# Altium project MKXdbV2.PrjPCB (part 1 of 2)
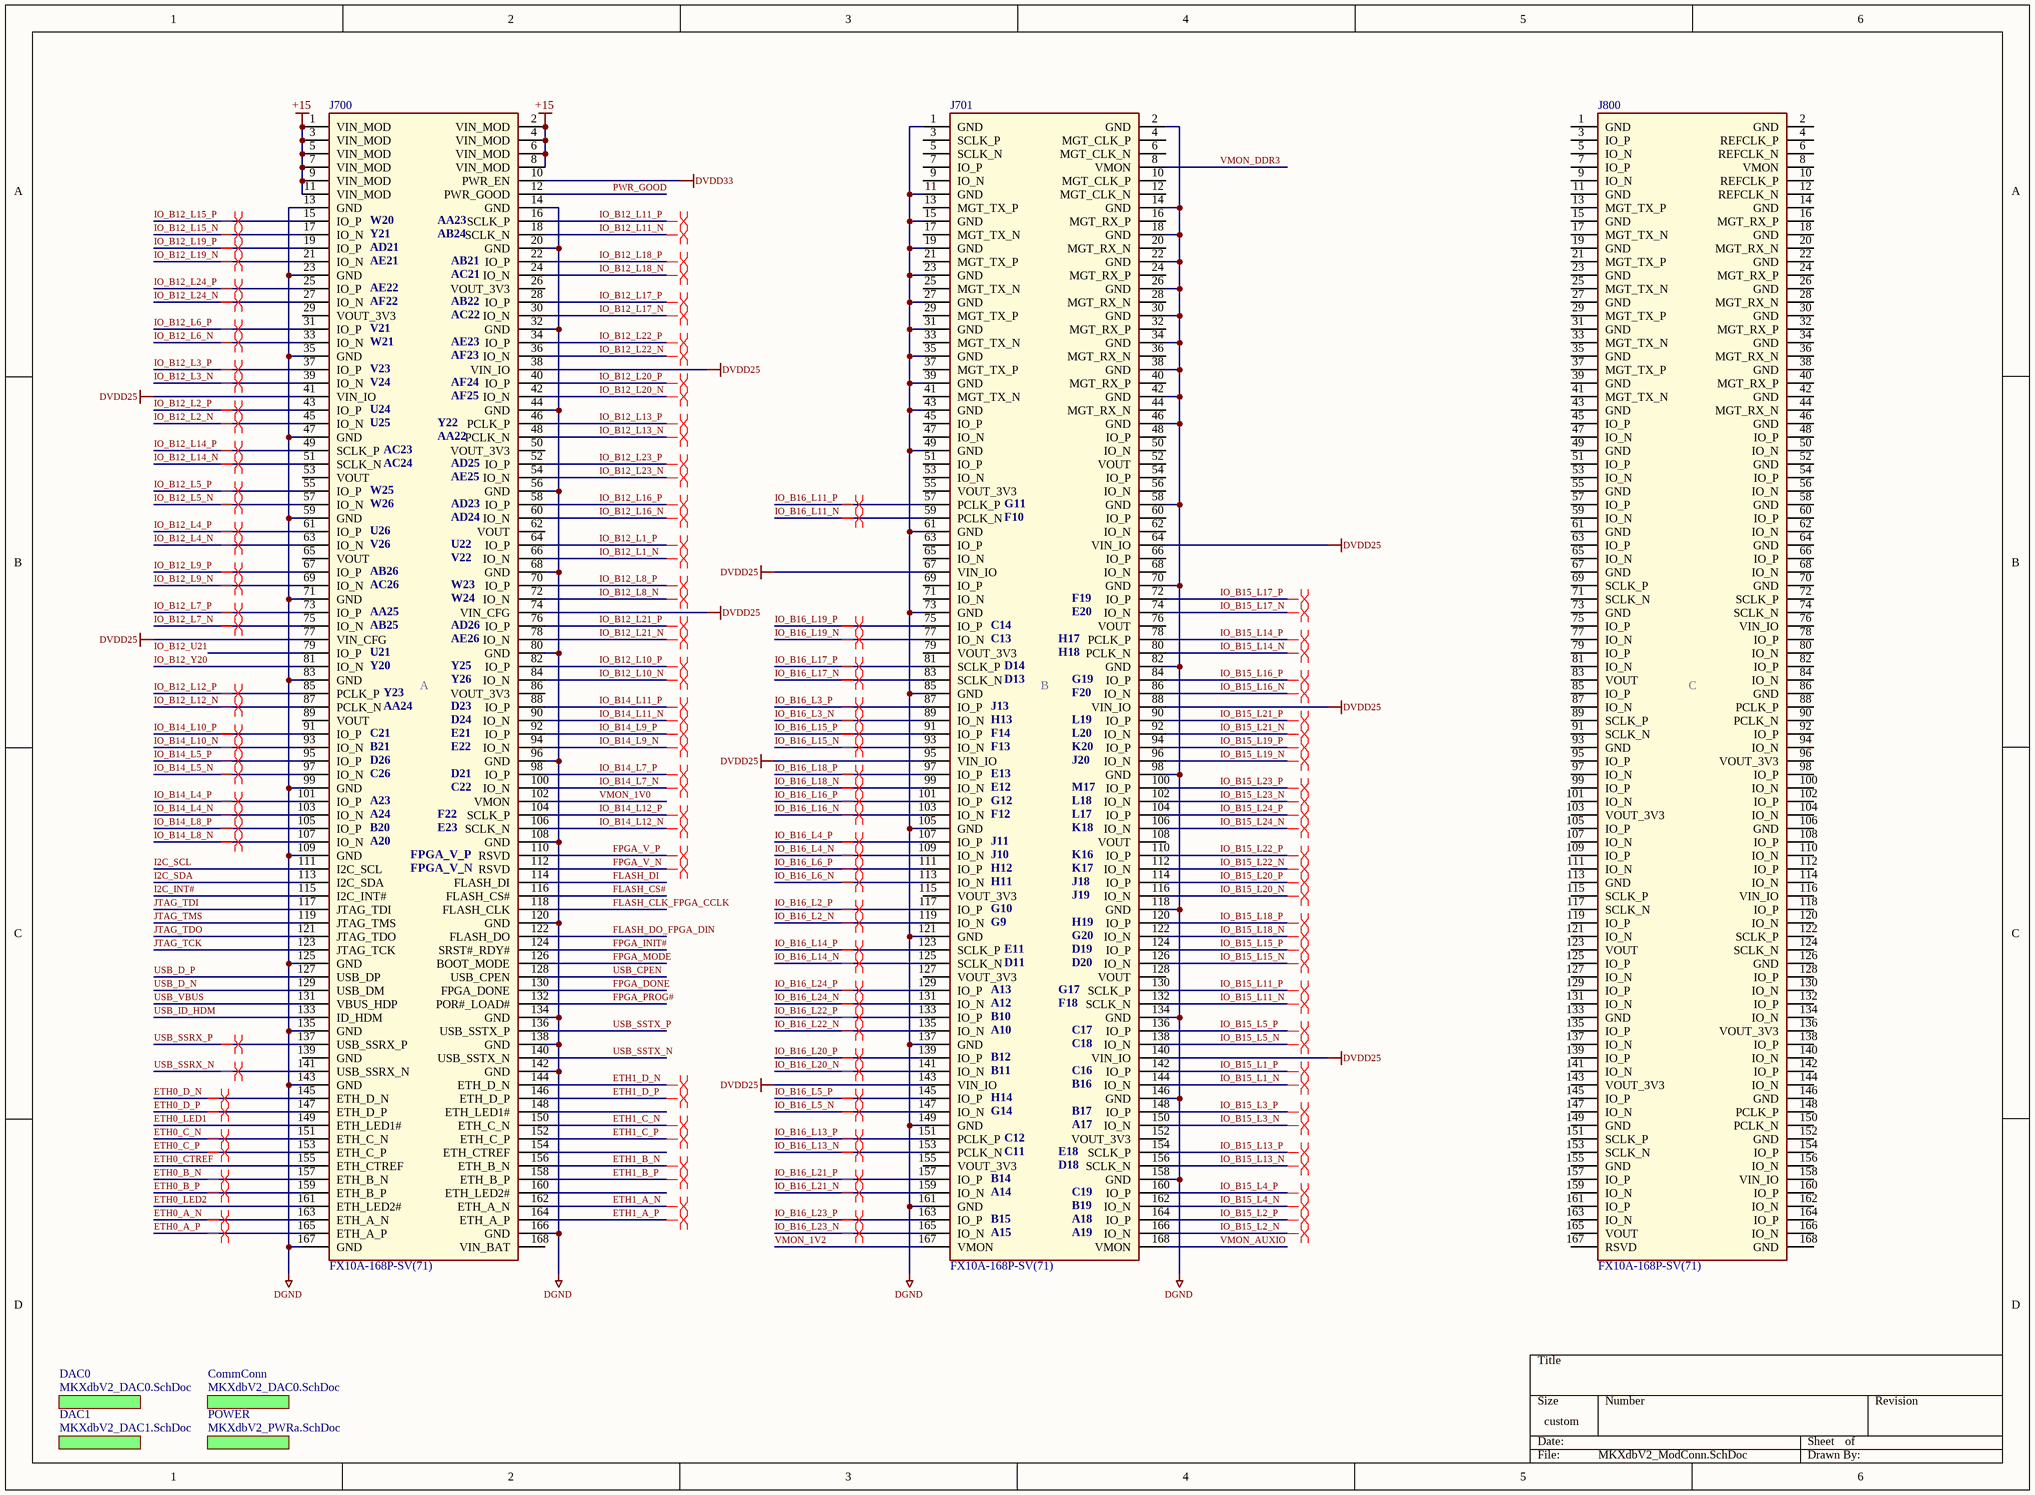
[diagram p0: MKXdbV2_ModConn.SchDoc]
6 sheets, 269 parts. Net scope: global (net labels, ports and power ports of the same name join across sheets).
Sheets:
  MKXdbV2_ModConn.SchDoc
    DAC1 = MKXdbV2_DAC1.SchDoc
    DAC0 = MKXdbV2_DAC0.SchDoc
    CommConn = MKXdbV2_DAC0.SchDoc
  MKXdbV2_PWR.SchDoc
  MKXdbV2_ADC0.SchDoc
  MKXdbV2_ADC1.SchDoc

## Sheet MKXdbV2_ModConn.SchDoc: Mercury KX1/2 daughterboard v2
size 381 x 279 mm; Date: 10 September 2017; DrawnBy: Daniel Schussheim; Revision: version 2; ProjectName: MKXbdV2

### Parts
J700  FX10A-168P-SV(71)  [Mercury_Baseboard_Connector]
J701  FX10A-168P-SV(71)  [Mercury_Baseboard_Connector]
J800  FX10A-168P-SV(71)  [Mercury_Baseboard_Connector]

### Sub-sheets
CommConn = MKXdbV2_DAC0.SchDoc: no entries
DAC0 = MKXdbV2_DAC0.SchDoc: no entries
DAC1 = MKXdbV2_DAC1.SchDoc: no entries
POWER = MKXdbV2_PWRa.SchDoc (file not in this document): no entries

### Nets
+15: J700.1(VIN_MOD) J700.2(VIN_MOD) J700.3(VIN_MOD) J700.4(VIN_MOD) J700.5(VIN_MOD) J700.6(VIN_MOD) J700.7(VIN_MOD) J700.8(VIN_MOD) J700.9(VIN_MOD) J700.11(VIN_MOD)
DGND: J700.13(GND) J700.14(GND) J700.20(GND) J700.23(GND) J700.32(GND) J700.35(GND) J700.44(GND) J700.47(GND) J700.56(GND) J700.59(GND) J700.68(GND) J700.71(GND) J700.80(GND) J700.83(GND) J700.96(GND) J700.99(GND) J700.108(GND) J700.109(GND) J700.120(GND) J700.125(GND) J700.134(GND) J700.135(GND) J700.138(GND) J700.142(GND) J700.143(GND) J700.166(GND) J700.167(GND) J701.1(GND) J701.2(GND) J701.11(GND) J701.14(GND) J701.15(GND) J701.18(GND) J701.19(GND) J701.22(GND) J701.23(GND) J701.26(GND) J701.27(GND) J701.30(GND) J701.31(GND) J701.34(GND) J701.35(GND) J701.38(GND) J701.39(GND) J701.42(GND) J701.43(GND) J701.46(GND) J701.49(GND) J701.58(GND) J701.61(GND) J701.70(GND) J701.73(GND) J701.82(GND) J701.85(GND) J701.98(GND) J701.105(GND) J701.118(GND) J701.121(GND) J701.134(GND) J701.137(GND) J701.146(GND) J701.149(GND) J701.158(GND) J701.161(GND)  [project net AGND]
DVDD25: J700.38(VIN_IO) J700.41(VIN_IO) J700.74(VIN_CFG) J700.77(VIN_CFG) J701.64(VIN_IO) J701.67(VIN_IO) J701.88(VIN_IO) J701.95(VIN_IO) J701.140(VIN_IO) J701.143(VIN_IO)
DVDD33: J700.10(PWR_EN)
ETH0_A_N: J700.163(ETH_A_N)
ETH0_A_P: J700.165(ETH_A_P)
ETH0_B_N: J700.157(ETH_B_N)
ETH0_B_P: J700.159(ETH_B_P)
ETH0_C_N: J700.151(ETH_C_N)
ETH0_C_P: J700.153(ETH_C_P)
ETH0_CTREF: J700.155(ETH_CTREF)
ETH0_D_N: J700.145(ETH_D_N)
ETH0_D_P: J700.147(ETH_D_P)
ETH0_LED1: J700.149(ETH_LED1#)
ETH0_LED2: J700.161(ETH_LED2#)
ETH1_A_N: J700.162(ETH_A_N)
ETH1_A_P: J700.164(ETH_A_P)
ETH1_B_N: J700.156(ETH_B_N)
ETH1_B_P: J700.158(ETH_B_P)
ETH1_C_N: J700.150(ETH_C_N)
ETH1_C_P: J700.152(ETH_C_P)
ETH1_D_N: J700.144(ETH_D_N)
ETH1_D_P: J700.146(ETH_D_P)
FLASH_CLK_FPGA_CCLK: J700.118(FLASH_CLK)
FLASH_CS#: J700.116(FLASH_CS#)
FLASH_DI: J700.114(FLASH_DI)
FLASH_DO_FPGA_DIN: J700.122(FLASH_DO)
FPGA_DONE: J700.130(FPGA_DONE)
FPGA_INIT#: J700.124(SRST#_RDY#)
FPGA_MODE: J700.126(BOOT_MODE)
FPGA_PROG#: J700.132(POR#_LOAD#)
FPGA_V_N: J700.112(RSVD)
FPGA_V_P: J700.110(RSVD)
I2C_INT#: J700.115(I2C_INT#)
I2C_SCL: J700.111(I2C_SCL)
I2C_SDA: J700.113(I2C_SDA)
IO_B12_L1_N: J700.66(IO_N)
IO_B12_L1_P: J700.64(IO_P)
IO_B12_L2_N: J700.45(IO_N)
IO_B12_L2_P: J700.43(IO_P)
IO_B12_L3_N: J700.39(IO_N)
IO_B12_L3_P: J700.37(IO_P)
IO_B12_L4_N: J700.63(IO_N)
IO_B12_L4_P: J700.61(IO_P)
IO_B12_L5_N: J700.57(IO_N)
IO_B12_L5_P: J700.55(IO_P)
IO_B12_L6_N: J700.33(IO_N)
IO_B12_L6_P: J700.31(IO_P)
IO_B12_L7_N: J700.75(IO_N)
IO_B12_L7_P: J700.73(IO_P)
IO_B12_L8_N: J700.72(IO_N)
IO_B12_L8_P: J700.70(IO_P)
IO_B12_L9_N: J700.69(IO_N)
IO_B12_L9_P: J700.67(IO_P)
IO_B12_L10_N: J700.84(IO_N)
IO_B12_L10_P: J700.82(IO_P)
IO_B12_L11_N: J700.18(SCLK_N)
IO_B12_L11_P: J700.16(SCLK_P)
IO_B12_L12_N: J700.87(PCLK_N)
IO_B12_L12_P: J700.85(PCLK_P)
IO_B12_L13_N: J700.48(PCLK_N)
IO_B12_L13_P: J700.46(PCLK_P)
IO_B12_L14_N: J700.51(SCLK_N)
IO_B12_L14_P: J700.49(SCLK_P)
IO_B12_L15_N: J700.17(IO_N)
IO_B12_L15_P: J700.15(IO_P)
IO_B12_L16_N: J700.60(IO_N)
IO_B12_L16_P: J700.58(IO_P)
IO_B12_L17_N: J700.30(IO_N)
IO_B12_L17_P: J700.28(IO_P)
IO_B12_L18_N: J700.24(IO_N)
IO_B12_L18_P: J700.22(IO_P)
IO_B12_L19_N: J700.21(IO_N)
IO_B12_L19_P: J700.19(IO_P)
IO_B12_L20_N: J700.42(IO_N)
IO_B12_L20_P: J700.40(IO_P)
IO_B12_L21_N: J700.78(IO_N)
IO_B12_L21_P: J700.76(IO_P)
IO_B12_L22_N: J700.36(IO_N)
IO_B12_L22_P: J700.34(IO_P)
IO_B12_L23_N: J700.54(IO_N)
IO_B12_L23_P: J700.52(IO_P)
IO_B12_L24_N: J700.27(IO_N)
IO_B12_L24_P: J700.25(IO_P)
IO_B12_Y20: J700.81(IO_N)
IO_B14_L4_N: J700.103(IO_N)
IO_B14_L4_P: J700.101(IO_P)
IO_B14_L5_N: J700.97(IO_N)
IO_B14_L5_P: J700.95(IO_P)
IO_B14_L7_N: J700.100(IO_N)
IO_B14_L7_P: J700.98(IO_P)
IO_B14_L8_N: J700.107(IO_N)
IO_B14_L8_P: J700.105(IO_P)
IO_B14_L9_N: J700.94(IO_N)
IO_B14_L9_P: J700.92(IO_P)
IO_B14_L10_N: J700.93(IO_N)
IO_B14_L10_P: J700.91(IO_P)
IO_B14_L11_N: J700.90(IO_N)
IO_B14_L11_P: J700.88(IO_P)
IO_B14_L12_N: J700.106(SCLK_N)
IO_B14_L12_P: J700.104(SCLK_P)
IO_B15_L1_N: J701.144(IO_N)
IO_B15_L1_P: J701.142(IO_P)
IO_B15_L2_N: J701.166(IO_N)
IO_B15_L2_P: J701.164(IO_P)
IO_B15_L3_N: J701.150(IO_N)
IO_B15_L3_P: J701.148(IO_P)
IO_B15_L4_N: J701.162(IO_N)
IO_B15_L4_P: J701.160(IO_P)
IO_B15_L5_N: J701.138(IO_N)
IO_B15_L5_P: J701.136(IO_P)
IO_B15_L11_N: J701.132(SCLK_N)
IO_B15_L11_P: J701.130(SCLK_P)
IO_B15_L13_N: J701.156(SCLK_N)
IO_B15_L13_P: J701.154(SCLK_P)
IO_B15_L14_N: J701.80(PCLK_N)
IO_B15_L14_P: J701.78(PCLK_P)
IO_B15_L15_N: J701.126(IO_N)
IO_B15_L15_P: J701.124(IO_P)
IO_B15_L16_N: J701.86(IO_N)
IO_B15_L16_P: J701.84(IO_P)
IO_B15_L17_N: J701.74(IO_N)
IO_B15_L17_P: J701.72(IO_P)
IO_B15_L18_N: J701.122(IO_N)
IO_B15_L18_P: J701.120(IO_P)
IO_B15_L19_N: J701.96(IO_N)
IO_B15_L19_P: J701.94(IO_P)
IO_B15_L20_N: J701.116(IO_N)
IO_B15_L20_P: J701.114(IO_P)
IO_B15_L21_N: J701.92(IO_N)
IO_B15_L21_P: J701.90(IO_P)
IO_B15_L22_N: J701.112(IO_N)
IO_B15_L22_P: J701.110(IO_P)
IO_B15_L23_N: J701.102(IO_N)
IO_B15_L23_P: J701.100(IO_P)
IO_B15_L24_N: J701.106(IO_N)
IO_B15_L24_P: J701.104(IO_P)
IO_B16_L2_N: J701.119(IO_N)
IO_B16_L2_P: J701.117(IO_P)
IO_B16_L3_N: J701.89(IO_N)
IO_B16_L3_P: J701.87(IO_P)
IO_B16_L4_N: J701.109(IO_N)
IO_B16_L4_P: J701.107(IO_P)
IO_B16_L5_N: J701.147(IO_N)
IO_B16_L5_P: J701.145(IO_P)
IO_B16_L6_N: J701.113(IO_N)
IO_B16_L6_P: J701.111(IO_P)
IO_B16_L11_N: J701.59(PCLK_N)
IO_B16_L11_P: J701.57(PCLK_P)
IO_B16_L13_N: J701.153(PCLK_N)
IO_B16_L13_P: J701.151(PCLK_P)
IO_B16_L14_N: J701.125(SCLK_N)
IO_B16_L14_P: J701.123(SCLK_P)
IO_B16_L15_N: J701.93(IO_N)
IO_B16_L15_P: J701.91(IO_P)
IO_B16_L16_N: J701.103(IO_N)
IO_B16_L16_P: J701.101(IO_P)
IO_B16_L17_N: J701.83(SCLK_N)
IO_B16_L17_P: J701.81(SCLK_P)
IO_B16_L18_N: J701.99(IO_N)
IO_B16_L18_P: J701.97(IO_P)
IO_B16_L19_N: J701.77(IO_N)
IO_B16_L19_P: J701.75(IO_P)
IO_B16_L20_N: J701.141(IO_N)
IO_B16_L20_P: J701.139(IO_P)
IO_B16_L21_N: J701.159(IO_N)
IO_B16_L21_P: J701.157(IO_P)
IO_B16_L22_N: J701.135(IO_N)
IO_B16_L22_P: J701.133(IO_P)
IO_B16_L23_N: J701.165(IO_N)
IO_B16_L23_P: J701.163(IO_P)
IO_B16_L24_N: J701.131(IO_N)
IO_B16_L24_P: J701.129(IO_P)
JTAG_TCK: J700.123(JTAG_TCK)
JTAG_TDI: J700.117(JTAG_TDI)
JTAG_TDO: J700.121(JTAG_TDO)
JTAG_TMS: J700.119(JTAG_TMS)
PWR_GOOD: J700.12(PWR_GOOD)
USB_CPEN: J700.128(USB_CPEN)
USB_D_N: J700.129(USB_DM)
USB_D_P: J700.127(USB_DP)
USB_ID_HDM: J700.133(ID_HDM)
USB_SSRX_N: J700.141(USB_SSRX_N)
USB_SSRX_P: J700.137(USB_SSRX_P)
USB_SSTX_N: J700.140(USB_SSTX_N)
USB_SSTX_P: J700.136(USB_SSTX_P)
USB_VBUS: J700.131(VBUS_HDP)
VMON_1V0: J700.102(VMON)
VMON_1V2: J701.167(VMON)
VMON_AUXIO: J701.168(VMON)
VMON_DDR3: J701.8(VMON)

Not connected (* = marked no-connect by the designer): J700 26(VOUT_3V3) 29(VOUT_3V3) 50(VOUT_3V3) 53(VOUT) 62(VOUT) 65(VOUT) 79(IO_P) 86(VOUT_3V3) 89(VOUT) 139(GND) 148(ETH_LED1#) 154(ETH_CTREF) 160(ETH_LED2#) 168(VIN_BAT); J701 3(SCLK_P) 4(MGT_CLK_P) 5(SCLK_N) 6(MGT_CLK_N) 7(IO_P) 9(IO_N) 10(MGT_CLK_P) 12(MGT_CLK_N) 13(MGT_TX_P) 16(MGT_RX_P) 17(MGT_TX_N) 20(MGT_RX_N) 21(MGT_TX_P) 24(MGT_RX_P) 25(MGT_TX_N) 28(MGT_RX_N) 29(MGT_TX_P) 32(MGT_RX_P) 33(MGT_TX_N) 36(MGT_RX_N) 37(MGT_TX_P) 40(MGT_RX_P) 41(MGT_TX_N) 44(MGT_RX_N) 45(IO_P) 47(IO_N) 48(IO_P) 50(IO_N) 51(IO_P) 52(VOUT) 53(IO_N) 54(IO_P) 55(VOUT_3V3) 56(IO_N) 60(IO_P) 62(IO_N) 63(IO_P) 65(IO_N) 66(IO_P) 68(IO_N) 69(IO_P) 71(IO_N) 76(VOUT) 79(VOUT_3V3) 108(VOUT) 115(VOUT_3V3) 127(VOUT_3V3) 128(VOUT) 152(VOUT_3V3) 155(VOUT_3V3); J800 1(GND) 2(GND) 3(IO_P) 4(REFCLK_P) 5(IO_N) 6(REFCLK_N) 7(IO_P) 8(VMON) 9(IO_N) 10(REFCLK_P) 11(GND) 12(REFCLK_N) 13(MGT_TX_P) 14(GND) 15(GND) 16(MGT_RX_P) 17(MGT_TX_N) 18(GND) 19(GND) 20(MGT_RX_N) 21(MGT_TX_P) 22(GND) 23(GND) 24(MGT_RX_P) 25(MGT_TX_N) 26(GND) 27(GND) 28(MGT_RX_N) 29(MGT_TX_P) 30(GND) 31(GND) 32(MGT_RX_P) 33(MGT_TX_N) 34(GND) 35(GND) 36(MGT_RX_N) 37(MGT_TX_P) 38(GND) 39(GND) 40(MGT_RX_P) 41(MGT_TX_N) 42(GND) 43(GND) 44(MGT_RX_N) 45(IO_P) 46(GND) 47(IO_N) 48(IO_P) 49(GND) 50(IO_N) 51(IO_P) 52(GND) 53(IO_N) 54(IO_P) 55(GND) 56(IO_N) 57(IO_P) 58(GND) 59(IO_N) 60(IO_P) 61(GND) 62(IO_N) 63(IO_P) 64(GND) 65(IO_N) 66(IO_P) 67(GND) 68(IO_N) 69(SCLK_P) 70(GND) 71(SCLK_N) 72(SCLK_P) 73(GND) 74(SCLK_N) 75(IO_P) 76(VIN_IO) 77(IO_N) 78(IO_P) 79(IO_P) 80(IO_N) 81(IO_N) 82(IO_P) 83(VOUT) 84(IO_N) 85(IO_P) 86(GND) 87(IO_N) 88(PCLK_P) 89(SCLK_P) 90(PCLK_N) 91(SCLK_N) 92(IO_P) 93(GND) 94(IO_N) 95(IO_P) 96(VOUT_3V3) 97(IO_N) 98(IO_P) 99(IO_P) 100(IO_N) 101(IO_N) 102(IO_P) 103(VOUT_3V3) 104(IO_N) 105(IO_P) 106(GND) 107(IO_N) 108(IO_P) 109(IO_P) 110(IO_N) 111(IO_N) 112(IO_P) 113(GND) 114(IO_N) 115(SCLK_P) 116(VIN_IO) 117(SCLK_N) 118(IO_P) 119(IO_P) 120(IO_N) 121(IO_N) 122(SCLK_P) 123(VOUT) 124(SCLK_N) 125(IO_P) 126(GND) 127(IO_N) 128(IO_P) 129(IO_P) 130(IO_N) 131(IO_N) 132(IO_P) 133(GND) 134(IO_N) 135(IO_P) 136(VOUT_3V3) 137(IO_N) 138(IO_P) 139(IO_P) 140(IO_N) 141(IO_N) 142(IO_P) 143(VOUT_3V3) 144(IO_N) 145(IO_P) 146(GND) 147(IO_N) 148(PCLK_P) 149(GND) 150(PCLK_N) 151(SCLK_P) 152(GND) 153(SCLK_N) 154(IO_P) 155(GND) 156(IO_N) 157(IO_P) 158(VIN_IO) 159(IO_N) 160(IO_P) 161(IO_P) 162(IO_N) 163(IO_N) 164(IO_P) 165(VOUT) 166(IO_N) 167(RSVD) 168(GND)

### Layout directives
differential pair: ETH0_A_N, ETH0_A_P, ETH0_B_N, ETH0_B_P, ETH0_C_N, ETH0_C_P, ETH0_D_N, ETH0_D_P, ETH1_A_N, ETH1_A_P, ETH1_B_N, ETH1_B_P, ETH1_C_N, ETH1_C_P, ETH1_D_N, ETH1_D_P, FPGA_V_N, FPGA_V_P, IO_B12_L1_N, IO_B12_L1_P, IO_B12_L2_N, IO_B12_L2_P, IO_B12_L3_N, IO_B12_L3_P, IO_B12_L4_N, IO_B12_L4_P, IO_B12_L5_N, IO_B12_L5_P, IO_B12_L6_N, IO_B12_L6_P, IO_B12_L7_N, IO_B12_L7_P, IO_B12_L8_N, IO_B12_L8_P, IO_B12_L9_N, IO_B12_L9_P, IO_B12_L10_N, IO_B12_L10_P, IO_B12_L11_N, IO_B12_L11_P, IO_B12_L12_N, IO_B12_L12_P, IO_B12_L13_N, IO_B12_L13_P, IO_B12_L14_N, IO_B12_L14_P, IO_B12_L15_N, IO_B12_L15_P, IO_B12_L16_N, IO_B12_L16_P, IO_B12_L17_N, IO_B12_L17_P, IO_B12_L18_N, IO_B12_L18_P, IO_B12_L19_N, IO_B12_L19_P, IO_B12_L20_N, IO_B12_L20_P, IO_B12_L21_N, IO_B12_L21_P, IO_B12_L22_N, IO_B12_L22_P, IO_B12_L23_N, IO_B12_L23_P, IO_B12_L24_N, IO_B12_L24_P, IO_B14_L4_N, IO_B14_L4_P, IO_B14_L5_N, IO_B14_L5_P, IO_B14_L7_N, IO_B14_L7_P, IO_B14_L8_N, IO_B14_L8_P, IO_B14_L9_N, IO_B14_L9_P, IO_B14_L10_N, IO_B14_L10_P, IO_B14_L11_N, IO_B14_L11_P, IO_B14_L12_N, IO_B14_L12_P, IO_B15_L1_N, IO_B15_L1_P, IO_B15_L2_N, IO_B15_L2_P, IO_B15_L3_N, IO_B15_L3_P, IO_B15_L4_N, IO_B15_L4_P, IO_B15_L5_N, IO_B15_L5_P, IO_B15_L11_N, IO_B15_L11_P, IO_B15_L13_N, IO_B15_L13_P, IO_B15_L14_N, IO_B15_L14_P, IO_B15_L15_N, IO_B15_L15_P, IO_B15_L16_N, IO_B15_L16_P, IO_B15_L17_N, IO_B15_L17_P, IO_B15_L18_N, IO_B15_L18_P, IO_B15_L19_N, IO_B15_L19_P, IO_B15_L20_N, IO_B15_L20_P, IO_B15_L21_N, IO_B15_L21_P, IO_B15_L22_N, IO_B15_L22_P, IO_B15_L23_N, IO_B15_L23_P, IO_B15_L24_N, IO_B15_L24_P, IO_B16_L2_N, IO_B16_L2_P, IO_B16_L3_N, IO_B16_L3_P, IO_B16_L4_N, IO_B16_L4_P, IO_B16_L5_N, IO_B16_L5_P, IO_B16_L6_N, IO_B16_L6_P, IO_B16_L11_N, IO_B16_L11_P, IO_B16_L13_N, IO_B16_L13_P, IO_B16_L14_N, IO_B16_L14_P, IO_B16_L15_N, IO_B16_L15_P, IO_B16_L16_N, IO_B16_L16_P, IO_B16_L17_N, IO_B16_L17_P, IO_B16_L18_N, IO_B16_L18_P, IO_B16_L19_N, IO_B16_L19_P, IO_B16_L20_N, IO_B16_L20_P, IO_B16_L21_N, IO_B16_L21_P, IO_B16_L22_N, IO_B16_L22_P, IO_B16_L23_N, IO_B16_L23_P, IO_B16_L24_N, IO_B16_L24_P, USB_SSRX_N, USB_SSRX_P

### Notes on the sheet
- (near J700) W20
- (near J700) AA23
- (near J700) Y21
- (near J700) AD21
- (near J700) AE21
- (near J700) AE22
- (near J700) AF22
- (near J700) AB24
- (near J700) AB21
- (near J700) AC21
- (near J700) AB22
- (near J700) V21
- (near J700) W21
- (near J700) AC22
- (near J700) AE23
- (near J700) AF23
- (near J700) V23
- (near J700) V24
- (near J700) U24
- (near J700) U25
- (near J700) Y22
- (near J700) AA22
- (near J700) AF24
- (near J700) AF25
- (near J700) W25
- (near J700) AC23
- (near J700) AC24
- (near J700) AD25
- (near J700) AE25
- (near J700) W26
- (near J700) U26
- (near J700) V26
- (near J700) AB26
- (near J700) AD23
- (near J700) AD24
- (near J700) U22
- (near J700) V22
- (near J701) G11
- (near J701) F10
- (near J700) AC26
- (near J700) AA25
- (near J700) AB25
- (near J700) W23
- (near J700) W24
- (near J700) AD26
- (near J701) C14
- (near J701) F19
- (near J701) E20
- (near J700) U21
- (near J700) Y20
- (near J700) Y23
- (near J700) AA24
- (near J700) AE26
- (near J700) Y25
- (near J700) Y26
- (near J700) D23
- (near J701) C13
- (near J701) J13
- (near J701) D14
- (near J701) D13
- (near J701) H17
- (near J701) H18
- (near J701) G19
- (near J701) F20
- (near J700) C21
- (near J700) B21
- (near J700) D26
- (near J700) D24
- (near J700) E21
- (near J700) E22
- (near J701) H13
- (near J701) F14
- (near J701) F13
- (near J701) L19
- (near J701) L20
- (near J701) K20
- (near J701) J20
- (near J700) C26
- (near J700) A23
- (near J700) A24
- (near J700) B20
- (near J700) A20
- (near J700) F22
- (near J700) E23
- (near J700) D21
- (near J700) C22
- (near J701) E13
- (near J701) E12
- (near J701) G12
- (near J701) F12
- (near J701) J11
- (near J701) M17
- (near J701) L18
- (near J701) L17
- (near J701) K18
- (near J700) FPGA_V_P
- (near J700) FPGA_V_N
- (near J701) J10
- (near J701) H12
- (near J701) H11
- (near J701) K16
- (near J701) K17
- (near J701) J18
- (near J701) J19
- (near J701) G10
- (near J701) G9
- (near J701) E11
- (near J701) D11
- (near J701) H19
- (near J701) G20
- (near J701) D19
- (near J701) D20
- (near J701) A13
- (near J701) A12
- (near J701) B10
- (near J701) A10
- (near J701) G17
- (near J701) F18
- (near J701) C17
- (near J701) B12
- (near J701) B11
- (near J701) H14
- (near J701) G14
- (near J701) C18
- (near J701) C16
- (near J701) B16
- (near J701) B17
- (near J701) C12
- (near J701) C11
- (near J701) E18
- (near J701) D18
- (near J701) A17
- (near J701) B14
- (near J701) A14
- (near J701) B15
- (near J701) A15
- (near J701) A19
- (near J701) B19
- (near J701) C19
- (near J701) A18
- Labels drawn without touching a wire or pin: IO_B12_U21
- (in symbol Mercury_Baseboard_Connector-A) A
- (in symbol Mercury_Baseboard_Connector-B) B
- (in symbol Mercury_Baseboard_Connector-C) C

### Library data of the parts
J700 = Mercury_Baseboard_Connector-A: Mercury Baseboard Connector; Manufacturer: Hirose; DistPartNumber: FX10A-168P-SV(71)-ND; Board_Variant: ALL; Check Sch: CG_2015-03-03; Enclustra PN: EN100374; Geometry.Height: 4mm stack height; Distributor: Digikey; Package: SMD - 168pin Hirose; ROHS: Yes; Supplier: Enclustra; Characteristics: -; Check PCB: -; Cost: 4.50; ManufPartNumber: FX10A-168P-SV(71); Temperature: -55..+85°C; Type: Connector; Value: FX10A-168P-SV(71)
J701 = Mercury_Baseboard_Connector-B: Mercury Baseboard Connector; Manufacturer: Hirose; DistPartNumber: FX10A-168P-SV(71)-ND; Board_Variant: ALL; Check Sch: CG_2015-03-03; Enclustra PN: EN100374; Geometry.Height: 4mm stack height; Distributor: Digikey; Package: SMD - 168pin Hirose; ROHS: Yes; Characteristics: -; Supplier: Enclustra; Check PCB: -; Cost: 4.50; ManufPartNumber: FX10A-168P-SV(71); Temperature: -55..+85°C; Type: Connector; Value: FX10A-168P-SV(71)
J800 = Mercury_Baseboard_Connector-C: Mercury Baseboard Connector; Manufacturer: Hirose; DistPartNumber: FX10A-168P-SV(71)-ND; Board_Variant: ALL; Check Sch: CG_2015-03-03; Enclustra PN: EN100374; Geometry.Height: 4mm stack height; Distributor: Digikey; Package: SMD - 168pin Hirose; ROHS: Yes; Characteristics: -; Supplier: Enclustra; Check PCB: -; Cost: 4.50; ManufPartNumber: FX10A-168P-SV(71); Temperature: -55..+85°C; Type: Connector; Value: FX10A-168P-SV(71)

## Sheet MKXdbV2_DAC1.SchDoc
size A
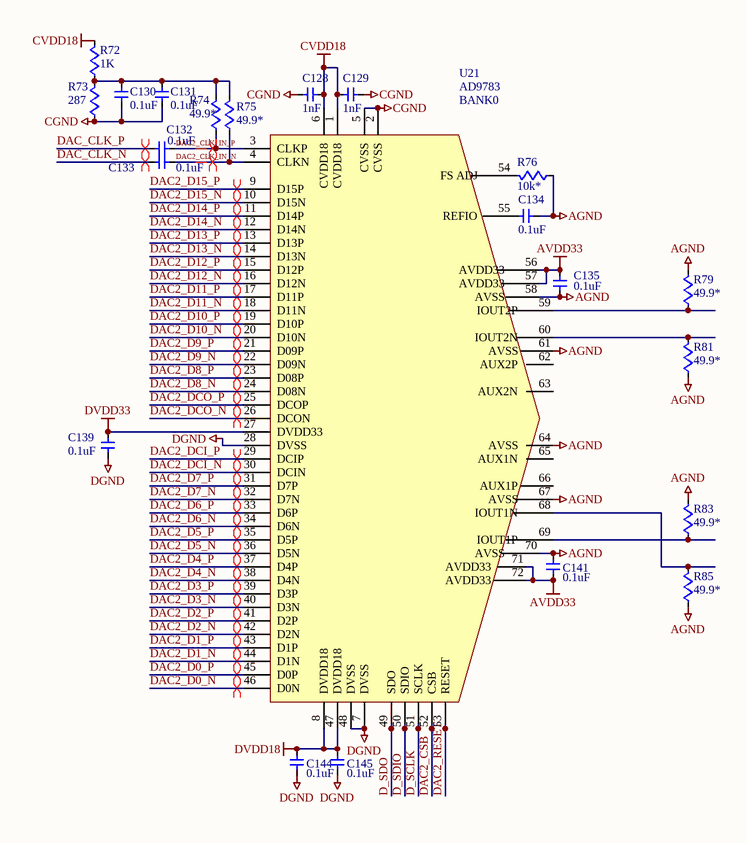
[diagram p1: MKXdbV2_DAC1.SchDoc]

### Parts
(Parts that share a designator on the sheet are numbered #1, #2 ... from top to bottom, then left to right.)
C128#1  1nF  [0603w]
C129#1  1nF  [0603w]
C130  0.1uF  [0603w]
C131  0.1uF  [0603w]
C132  0.1uF  [1206]
C133  0.1uF  [1206]
C134  0.1uF  [0603w]
C135  0.1uF  [0603w]
C139  0.1uF  [0603w]
C141  0.1uF  [0603w]
C144  0.1uF  [0603w]
C145  0.1uF  [0603w]
R72  1K  [0603w]
R73  287  [0603w]
R74  49.9*  [0603w]
R75  49.9*  [0603w]
R76  10k*  [0603w]
R79  49.9*  [0603w]
R81  49.9*  [0603w]
R83  49.9*  [0603w]
R85  49.9*  [0603w]
U21  AD9783  [LFCSP72]

### Nets
AGND: C128#1.2 C129#1.2 C130.2 C131.2 C134.2 C135.1 C139.2 C141.2 C144.1 C145.1 R73.1 R76.1 R79.2 R81.1 R83.2 R85.1 U21.2(CVSS) U21.5(CVSS) U21.7(DVSS) U21.28(DVSS) U21.48(DVSS) U21.58(AVSS) U21.61(AVSS) U21.64(AVSS) U21.67(AVSS) U21.70(AVSS)  [also labelled CGND, DGND]
AVDD33: C135.2 C141.1 U21.56(AVDD33) U21.57(AVDD33) U21.71(AVDD33) U21.72(AVDD33)
CVDD18: C128#1.1 C129#1.1 R72.2 U21.1(CVDD18) U21.6(CVDD18)
DVDD18: C144.2 C145.2 U21.8(DVDD18) U21.47(DVDD18)
DVDD33: C139.1 U21.27(DVDD33)
D_SCLK: U21.51(SCLK)
D_SDIO: U21.50(SDIO)
D_SDO: U21.49(SDO)
DAC2_CLK_IN_N: C133.2 R75.1 U21.4(CLKN)
DAC2_CLK_IN_P: C132.2 R74.1 U21.3(CLKP)
DAC2_CSB: U21.52(CSB)
DAC2_D0_N: U21.46(D0N)
DAC2_D0_P: U21.45(D0P)
DAC2_D1_N: U21.44(D1N)
DAC2_D1_P: U21.43(D1P)
DAC2_D2_N: U21.42(D2N)
DAC2_D2_P: U21.41(D2P)
DAC2_D3_N: U21.40(D3N)
DAC2_D3_P: U21.39(D3P)
DAC2_D4_N: U21.38(D4N)
DAC2_D4_P: U21.37(D4P)
DAC2_D5_N: U21.36(D5N)
DAC2_D5_P: U21.35(D5P)
DAC2_D6_N: U21.34(D6N)
DAC2_D6_P: U21.33(D6P)
DAC2_D7_N: U21.32(D7N)
DAC2_D7_P: U21.31(D7P)
DAC2_D8_N: U21.24(D08N)
DAC2_D8_P: U21.23(D08P)
DAC2_D9_N: U21.22(D09N)
DAC2_D9_P: U21.21(D09P)
DAC2_D10_N: U21.20(D10N)
DAC2_D10_P: U21.19(D10P)
DAC2_D11_N: U21.18(D11N)
DAC2_D11_P: U21.17(D11P)
DAC2_D12_N: U21.16(D12N)
DAC2_D12_P: U21.15(D12P)
DAC2_D13_N: U21.14(D13N)
DAC2_D13_P: U21.13(D13P)
DAC2_D14_N: U21.12(D14N)
DAC2_D14_P: U21.11(D14P)
DAC2_D15_N: U21.10(D15N)
DAC2_D15_P: U21.9(D15P)
DAC2_DCI_N: U21.30(DCIN)
DAC2_DCI_P: U21.29(DCIP)
DAC2_DCO_N: U21.26(DCON)
DAC2_DCO_P: U21.25(DCOP)
DAC2_RESET: U21.53(RESET)
DAC_CLK_N: C133.1
DAC_CLK_P: C132.1
NetC130_1: C130.1 C131.1 R72.1 R73.2 R74.2 R75.2
NetC134_1: C134.1 U21.55(REFIO)
NetR76_2: R76.2 U21.54(FS_ADJ)
NetR79_1: R79.1 U21.59(IOUT2P)
NetR81_2: R81.2 U21.60(IOUT2N)
NetR83_1: R83.1 U21.69(IOUT1P)
NetR85_2: R85.2 U21.68(IOUT1N)

Not connected (* = marked no-connect by the designer): U21 62(AUX2P) 63(AUX2N) 65(AUX1N) 66(AUX1P)

### Layout directives
differential pair: DAC2_CLK_IN_N, DAC2_CLK_IN_P, DAC2_D0_N, DAC2_D0_P, DAC2_D1_N, DAC2_D1_P, DAC2_D2_N, DAC2_D2_P, DAC2_D3_N, DAC2_D3_P, DAC2_D4_N, DAC2_D4_P, DAC2_D5_N, DAC2_D5_P, DAC2_D6_N, DAC2_D6_P, DAC2_D7_N, DAC2_D7_P, DAC2_D8_N, DAC2_D8_P, DAC2_D9_N, DAC2_D9_P, DAC2_D10_N, DAC2_D10_P, DAC2_D11_N, DAC2_D11_P, DAC2_D12_N, DAC2_D12_P, DAC2_D13_N, DAC2_D13_P, DAC2_D14_N, DAC2_D14_P, DAC2_D15_N, DAC2_D15_P, DAC2_DCI_N, DAC2_DCI_P, DAC2_DCO_N, DAC2_DCO_P, DAC_CLK_N, DAC_CLK_P

### Notes on the sheet
- (near U21) BANK0

### Library data of the parts
C128#1 C129#1 = CAP_SM_1: capacitor; Manufacturer: Murata Electronics North America; Manufacturer Part Number: GRM188R71H102KA01D; Capacitance: 1000pF; Voltage - Rated: 50V; Tolerance: ±10%; Temperature Coefficient: X7R; Supplier 1: Digi-Key; Supplier Part Number 1: 490-1494-1-ND; RoHS: RoHS Compliant; Category: Capacitors; Stock 1: 512721; Pricing 1: 1=0.07, 10=0.043, 50=0.0204, 100=0.0153, 250=0.01104, 500=0.00816, 1000=0.00553 (USD); Mounting Type: Surface Mount, MLCC; Operating Temperature: -55°C ~ 125°C; Applications: General Purpose; Ratings: -; Package / Case: 0603 (1608 Metric); Size / Dimension: 0.063" L x 0.031" W (1.60mm x 0.80mm); Height: -; Thickness: 0.035" (0.90mm); Lead Spacing: -; Features: -; Packaging: Cut Tape (CT); Lead Style: -; ComponentLink1URL: http://search.murata.co.jp/Ceramy/image/img/PDF/ENG/GRM188R71H102KA01.pdf; ComponentLink1Description: http://search.murata.co.jp/Ceramy/image/img/PDF/ENG/GRM188R71H102KA01.pdf
C130 = CAP_SM: capacitor; Manufacturer: Kemet; Manufacturer Part Number: C0603C104K3RACTU; Capacitance: 0.1µF; Temperature Coefficient: X7R; Tolerance: ±10%; Voltage - Rated: 25V; Applications: General Purpose; Category: Capacitors; ComponentLink1Description: http://www.kemet.com/datasheets&C0603C104K3RACTU; ComponentLink1URL: http://www.kemet.com/datasheets&C0603C104K3RACTU; Features: -; Lead Spacing: -; Lead Style: -; Mounting Type: Surface Mount, MLCC; Operating Temperature: -55°C ~ 125°C; Package / Case: 0603 (1608 Metric); Packaging: Cut Tape (CT); Pricing 1: 10=0.075, 100=0.027, 250=0.01952, 500=0.0144, 1000=0.00975 (USD); Ratings: -; RoHS: RoHS Compliant; Size / Dimension: 0.063" L x 0.032" W (1.60mm x 0.80mm); Stock 1: 2338960; Supplier 1: Digi-Key; Supplier Part Number 1: 399-1281-1-ND; Thickness: 0.80mm
C131 = CAP_SM: capacitor; Manufacturer: Kemet; Manufacturer Part Number: C0603C104K3RACTU; Capacitance: 0.1µF; Voltage - Rated: 25V; Tolerance: ±10%; Temperature Coefficient: X7R; Supplier 1: Digi-Key; Supplier Part Number 1: 399-1281-1-ND; RoHS: RoHS Compliant; Category: Capacitors; Stock 1: 2338960; Pricing 1: 10=0.075, 100=0.027, 250=0.01952, 500=0.0144, 1000=0.00975 (USD); Mounting Type: Surface Mount, MLCC; Operating Temperature: -55°C ~ 125°C; Applications: General Purpose; Ratings: -; Package / Case: 0603 (1608 Metric); Size / Dimension: 0.063" L x 0.032" W (1.60mm x 0.80mm); Thickness: 0.80mm; Lead Spacing: -; Features: -; Packaging: Cut Tape (CT); Lead Style: -; ComponentLink1URL: http://www.kemet.com/datasheets&C0603C104K3RACTU; ComponentLink1Description: http://www.kemet.com/datasheets&C0603C104K3RACTU
C132 C133 = CAP_SM_1: capacitor; Manufacturer: Murata Electronics North America; Manufacturer Part Number: GRM31C5C1E104JA01L; Capacitance: 0.1µF; Voltage - Rated: 25V; Tolerance: ±5%; Temperature Coefficient: C0G, NP0; Supplier 1: Digi-Key; Supplier Part Number 1: 490-1767-1-ND; RoHS: RoHS Compliant; Category: Capacitors; Stock 1: 374793; Pricing 1: 1=0.57, 10=0.48, 50=0.3436, 100=0.3007, 250=0.23628, 500=0.2148, 1000=0.17184 (USD); Mounting Type: Surface Mount, MLCC; Operating Temperature: -55°C ~ 125°C; Applications: General Purpose; Ratings: -; Package / Case: 1206 (3216 Metric); Size / Dimension: 0.126" L x 0.063" W (3.20mm x 1.60mm); Height: -; Thickness: 0.071" (1.80mm); Lead Spacing: -; Features: -; Packaging: Cut Tape (CT); Lead Style: -; ComponentLink1URL: http://search.murata.co.jp/Ceramy/image/img/PDF/ENG/GRM31C5C1E104JA01.pdf; ComponentLink1Description: http://search.murata.co.jp/Ceramy/image/img/PDF/ENG/GRM31C5C1E104JA01.pdf
C134 C135 C139 C141 C144 C145 = CAP_SM_1: capacitor; Manufacturer: Kemet; Manufacturer Part Number: C0603C104K3RACTU; Capacitance: 0.1µF; Temperature Coefficient: X7R; Tolerance: ±10%; Voltage - Rated: 25V; Applications: General Purpose; Category: Capacitors; ComponentLink1Description: http://www.kemet.com/datasheets&C0603C104K3RACTU; ComponentLink1URL: http://www.kemet.com/datasheets&C0603C104K3RACTU; Features: -; Lead Spacing: -; Lead Style: -; Mounting Type: Surface Mount, MLCC; Operating Temperature: -55°C ~ 125°C; Package / Case: 0603 (1608 Metric); Packaging: Cut Tape (CT); Pricing 1: 10=0.075, 100=0.027, 250=0.01952, 500=0.0144, 1000=0.00975 (USD); Ratings: -; RoHS: RoHS Compliant; Size / Dimension: 0.063" L x 0.032" W (1.60mm x 0.80mm); Stock 1: 2338960; Supplier 1: Digi-Key; Supplier Part Number 1: 399-1281-1-ND; Thickness: 0.80mm
R72 = RES_SM: resistor; Manufacturer: Yageo; Manufacturer Part Number: RC0603FR-071KL; Power (Watts): 0.1W, 1/10W; Temperature Coefficient: ±100ppm/°C; Tolerance: ±1%; Supplier 1: Digi-Key; Supplier Part Number 1: 311-1.00KHRCT-ND; RoHS: RoHS Compliant; Category: Resistors; Stock 1: 4416298; Pricing 1: 10=0.014, 50=0.0104, 100=0.0079, 250=0.00584, 500=0.00432, 1000=0.00288 (USD); Resistance (Ohms): 1K; Composition: Thick Film; Features: -; Size / Dimension: 0.063" L x 0.031" W (1.60mm x 0.80mm); Height: 0.018" (0.45mm); Number of Terminations: 2; Packaging: Cut Tape (CT); Package / Case: 0603 (1608 Metric); ComponentLink1URL: http://www.yageo.com/documents/recent/PYu-RC0603_51_RoHS_L_4.pdf; ComponentLink1Description: http://www.yageo.com/documents/recent/PYu-RC0603_51_RoHS_L_4.pdf
R73 = RES_SM: resistor; Manufacturer: Yageo; Manufacturer Part Number: RC0603FR-07287RL; Power (Watts): 0.1W, 1/10W; Temperature Coefficient: ±100ppm/°C; Tolerance: ±1%; Supplier 1: Digi-Key; Supplier Part Number 1: 311-287HRCT-ND; RoHS: RoHS Compliant; Category: Resistors; Stock 1: 82528; Pricing 1: 10=0.014, 50=0.0104, 100=0.0079, 250=0.00584, 500=0.00432, 1000=0.00288 (USD); Resistance (Ohms): 287; Composition: Thick Film; Features: -; Size / Dimension: 0.063" L x 0.031" W (1.60mm x 0.80mm); Height: 0.018" (0.45mm); Number of Terminations: 2; Packaging: Cut Tape (CT); Package / Case: 0603 (1608 Metric); ComponentLink1URL: http://www.yageo.com/documents/recent/PYu-RC0603_51_RoHS_L_4.pdf; ComponentLink1Description: http://www.yageo.com/documents/recent/PYu-RC0603_51_RoHS_L_4.pdf
R74 R75 R79 R81 R83 R85 = RES_SM: resistor; Manufacturer: Stackpole Electronics Inc; Manufacturer Part Number: RNCS0603BKE49R9; Resistance (Ohms): 49.9; Power (Watts): 0.063W, 1/16W; Temperature Coefficient: ±25ppm/°C; Tolerance: ±0.1%; Supplier 1: Digi-Key; Supplier Part Number 1: RNCS0603BKE49R9CT-ND; RoHS: RoHS Compliant; Category: Resistors; Stock 1: 13782; Pricing 1: 1=0.7, 10=0.475, 50=0.2876, 100=0.2375, 250=0.18752, 500=0.16 (USD); Composition: Thin Film; Features: Anti-Corrosive, Moisture Resistant; Size / Dimension: 0.061" L x 0.031" W (1.55mm x 0.80mm); Height: 0.018" (0.45mm); Number of Terminations: 2; Packaging: Cut Tape (CT); Package / Case: 0603 (1608 Metric); ComponentLink1URL: http://www.seielect.com/Catalog/SEI-rncs.pdf; ComponentLink1Description: http://www.seielect.com/Catalog/SEI-rncs.pdf
R76 = RES_SM: resistor; Manufacturer: Susumu; Manufacturer Part Number: RG1608P-103-B-T5; Resistance (Ohms): 10K; Power (Watts): 0.1W, 1/10W; Temperature Coefficient: ±25ppm/°C; Tolerance: ±0.1%; Supplier 1: Digi-Key; Supplier Part Number 1: RG16P10.0KBCT-ND; RoHS: RoHS Compliant; Category: Resistors; Stock 1: 368390; Pricing 1: 10=0.409, 50=0.2478, 200=0.2047, 1000=0.10342 (USD); Composition: Thin Film; Features: -; Size / Dimension: 0.063" L x 0.031" W (1.60mm x 0.80mm); Height: 0.016" (0.40mm); Number of Terminations: 2; Packaging: Cut Tape (CT); Package / Case: 0603 (1608 Metric); ComponentLink1URL: http://www.susumu-usa.com/pdf/RG_RM_RGH_DATASHEET.pdf; ComponentLink1Description: http://www.susumu-usa.com/pdf/RG_RM_RGH_DATASHEET.pdf
U21 = AD9783: DAC LVDS DUAL16BIT 500MSPS; Supplier 1: Digi-Key; Supplier Part Number 1: AD9783BCPZ-ND

## Sheet MKXdbV2_DAC0.SchDoc
size A
Used 2 times, as channels DAC0, CommConn. Parts and nets are listed once, with the designators drawn on the sheet.
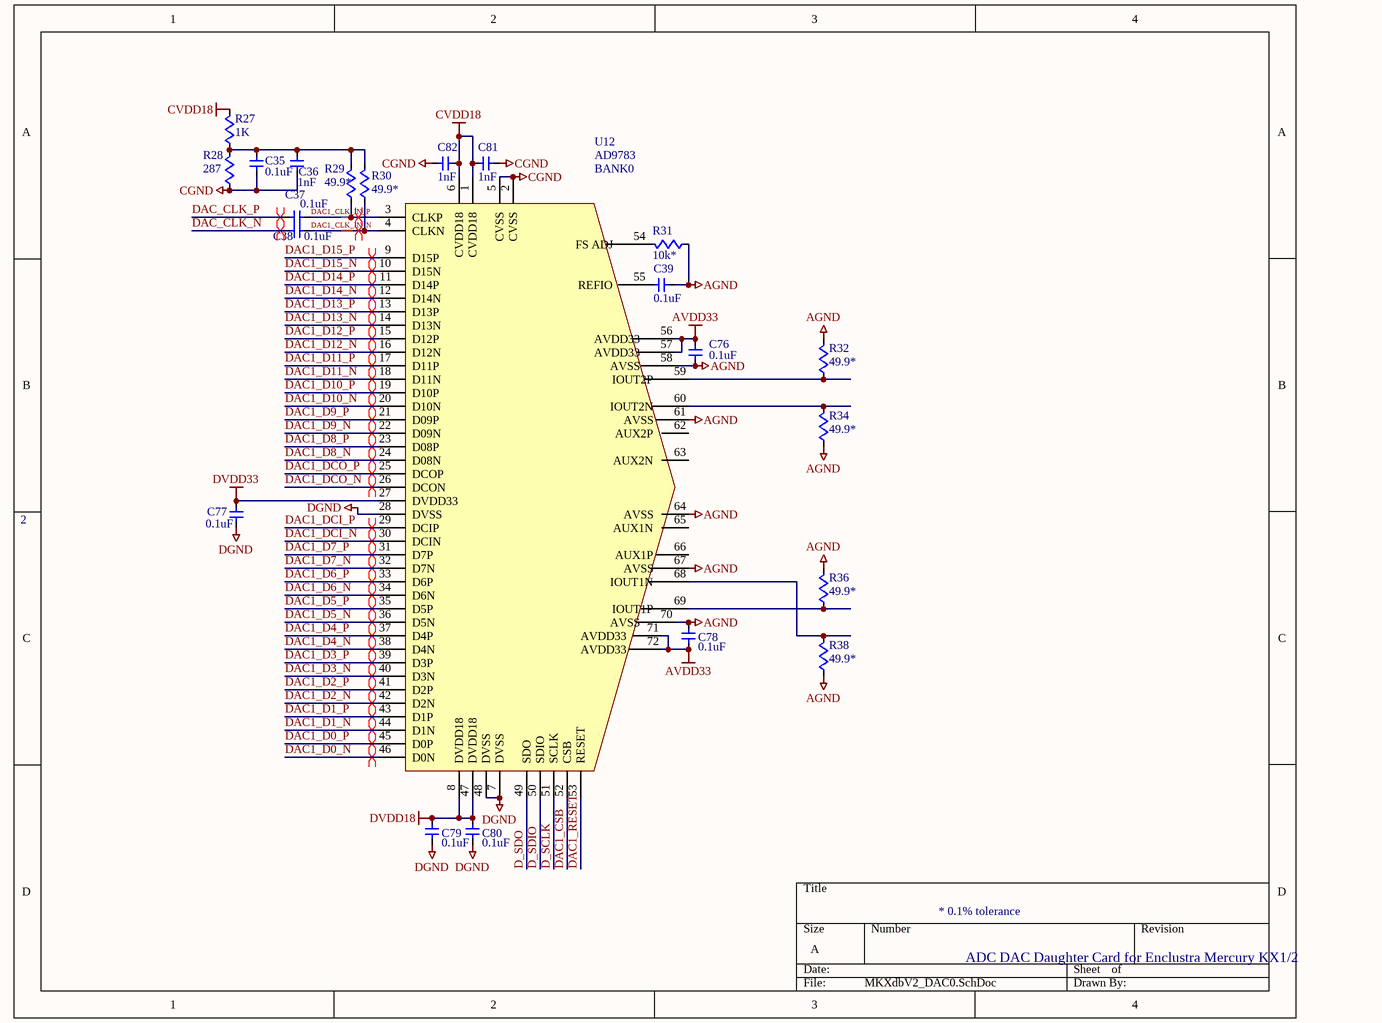
[diagram p2: MKXdbV2_DAC0.SchDoc]

### Parts
C35  0.1uF  [0603w]
C36  1nF  [0603w]
C37  0.1uF  [1206]
C38  0.1uF  [1206]
C39  0.1uF  [0603w]
C76  0.1uF  [0603w]
C77  0.1uF  [0603w]
C78  0.1uF  [0603w]
C79  0.1uF  [0603w]
C80  0.1uF  [0603w]
C81  1nF  [0603w]
C82  1nF  [0603w]
R27  1K  [0603w]
R28  287  [0603w]
R29  49.9*  [0603w]
R30  49.9*  [0603w]
R31  10k*  [0603w]
R32  49.9*  [0603w]
R34  49.9*  [0603w]
R36  49.9*  [0603w]
R38  49.9*  [0603w]
U12  AD9783  [LFCSP72]

### Nets
AGND: C39.2 C76.1 C78.2 R31.1 R32.2 R34.1 R36.2 R38.1 U12.58(AVSS) U12.61(AVSS) U12.64(AVSS) U12.67(AVSS) U12.70(AVSS)
AVDD33: C76.2 C78.1 U12.56(AVDD33) U12.57(AVDD33) U12.71(AVDD33) U12.72(AVDD33)
CGND: C35.2 C36.2 C81.2 C82.2 R28.1 U12.2(CVSS) U12.5(CVSS)
CVDD18: C81.1 C82.1 R27.2 U12.1(CVDD18) U12.6(CVDD18)
DGND: C77.2 C79.1 C80.1 U12.7(DVSS) U12.28(DVSS) U12.48(DVSS)
DVDD18: C79.2 C80.2 U12.8(DVDD18) U12.47(DVDD18)
DVDD33: C77.1 U12.27(DVDD33)
D_SCLK: U12.51(SCLK)
D_SDIO: U12.50(SDIO)
D_SDO: U12.49(SDO)
DAC1_CLK_IN_N: C38.2 R30.1 U12.4(CLKN)
DAC1_CLK_IN_P: C37.2 R29.1 U12.3(CLKP)
DAC1_CSB: U12.52(CSB)
DAC1_D0_N: U12.46(D0N)
DAC1_D0_P: U12.45(D0P)
DAC1_D1_N: U12.44(D1N)
DAC1_D1_P: U12.43(D1P)
DAC1_D2_N: U12.42(D2N)
DAC1_D2_P: U12.41(D2P)
DAC1_D3_N: U12.40(D3N)
DAC1_D3_P: U12.39(D3P)
DAC1_D4_N: U12.38(D4N)
DAC1_D4_P: U12.37(D4P)
DAC1_D5_N: U12.36(D5N)
DAC1_D5_P: U12.35(D5P)
DAC1_D6_N: U12.34(D6N)
DAC1_D6_P: U12.33(D6P)
DAC1_D7_N: U12.32(D7N)
DAC1_D7_P: U12.31(D7P)
DAC1_D8_N: U12.24(D08N)
DAC1_D8_P: U12.23(D08P)
DAC1_D9_N: U12.22(D09N)
DAC1_D9_P: U12.21(D09P)
DAC1_D10_N: U12.20(D10N)
DAC1_D10_P: U12.19(D10P)
DAC1_D11_N: U12.18(D11N)
DAC1_D11_P: U12.17(D11P)
DAC1_D12_N: U12.16(D12N)
DAC1_D12_P: U12.15(D12P)
DAC1_D13_N: U12.14(D13N)
DAC1_D13_P: U12.13(D13P)
DAC1_D14_N: U12.12(D14N)
DAC1_D14_P: U12.11(D14P)
DAC1_D15_N: U12.10(D15N)
DAC1_D15_P: U12.9(D15P)
DAC1_DCI_N: U12.30(DCIN)
DAC1_DCI_P: U12.29(DCIP)
DAC1_DCO_N: U12.26(DCON)
DAC1_DCO_P: U12.25(DCOP)
DAC1_RESET: U12.53(RESET)
DAC_CLK_N: C38.1
DAC_CLK_P: C37.1
NetC35_1: C35.1 C36.1 R27.1 R28.2 R29.2 R30.2
NetC39_1: C39.1 U12.55(REFIO)
NetR31_2: R31.2 U12.54(FS_ADJ)
NetR32_1: R32.1 U12.59(IOUT2P)
NetR34_2: R34.2 U12.60(IOUT2N)
NetR36_1: R36.1 U12.69(IOUT1P)
NetR38_2: R38.2 U12.68(IOUT1N)

Not connected (* = marked no-connect by the designer): U12 62(AUX2P) 63(AUX2N) 65(AUX1N) 66(AUX1P)

### Channels
DAC0: designators end in _DAC0
CommConn: designators end in _CommConn

### Layout directives
differential pair: DAC1_CLK_IN_N, DAC1_CLK_IN_P, DAC1_D0_N, DAC1_D0_P, DAC1_D1_N, DAC1_D1_P, DAC1_D2_N, DAC1_D2_P, DAC1_D3_N, DAC1_D3_P, DAC1_D4_N, DAC1_D4_P, DAC1_D5_N, DAC1_D5_P, DAC1_D6_N, DAC1_D6_P, DAC1_D7_N, DAC1_D7_P, DAC1_D8_N, DAC1_D8_P, DAC1_D9_N, DAC1_D9_P, DAC1_D10_N, DAC1_D10_P, DAC1_D11_N, DAC1_D11_P, DAC1_D12_N, DAC1_D12_P, DAC1_D13_N, DAC1_D13_P, DAC1_D14_N, DAC1_D14_P, DAC1_D15_N, DAC1_D15_P, DAC1_DCI_N, DAC1_DCI_P, DAC1_DCO_N, DAC1_DCO_P, DAC_CLK_N, DAC_CLK_P

### Notes on the sheet
- (near U12) BANK0
- 2
- * 0.1% tolerance
- ADC DAC Daughter Card for Enclustra Mercury KX1/2

### Library data of the parts
C35 C39 C76-C80 = CAP_SM_1: as C134 on sheet MKXdbV2_DAC1; Applications: General Purpose; Category: Capacitors; ComponentLink1Description: http://www.kemet.com/datasheets&C0603C104K3RACTU; ComponentLink1URL: http://www.kemet.com/datasheets&C0603C104K3RACTU; Features: -; Lead Spacing: -; Lead Style: -; Mounting Type: Surface Mount, MLCC; Operating Temperature: -55°C ~ 125°C; Package / Case: 0603 (1608 Metric); Packaging: Cut Tape (CT); Pricing 1: 10=0.075, 100=0.027, 250=0.01952, 500=0.0144, 1000=0.00975 (USD); Ratings: -; RoHS: RoHS Compliant; Size / Dimension: 0.063" L x 0.032" W (1.60mm x 0.80mm); Stock 1: 2338960; Supplier 1: Digi-Key; Supplier Part Number 1: 399-1281-1-ND; Thickness: 0.80mm
C36 C81 C82 = CAP_SM_1: as C128#1 on sheet MKXdbV2_DAC1; Supplier 1: Digi-Key; Supplier Part Number 1: 490-1494-1-ND; RoHS: RoHS Compliant; Category: Capacitors; Stock 1: 512721; Pricing 1: 1=0.07, 10=0.043, 50=0.0204, 100=0.0153, 250=0.01104, 500=0.00816, 1000=0.00553 (USD); Mounting Type: Surface Mount, MLCC; Operating Temperature: -55°C ~ 125°C; Applications: General Purpose; Ratings: -; Package / Case: 0603 (1608 Metric); Size / Dimension: 0.063" L x 0.031" W (1.60mm x 0.80mm); Height: -; Thickness: 0.035" (0.90mm); Lead Spacing: -; Features: -; Packaging: Cut Tape (CT); Lead Style: -; ComponentLink1URL: http://search.murata.co.jp/Ceramy/image/img/PDF/ENG/GRM188R71H102KA01.pdf; ComponentLink1Description: http://search.murata.co.jp/Ceramy/image/img/PDF/ENG/GRM188R71H102KA01.pdf
C37 C38 = CAP_SM_1: as C132 on sheet MKXdbV2_DAC1; Supplier 1: Digi-Key; Supplier Part Number 1: 490-1767-1-ND; RoHS: RoHS Compliant; Category: Capacitors; Stock 1: 374793; Pricing 1: 1=0.57, 10=0.48, 50=0.3436, 100=0.3007, 250=0.23628, 500=0.2148, 1000=0.17184 (USD); Mounting Type: Surface Mount, MLCC; Operating Temperature: -55°C ~ 125°C; Applications: General Purpose; Ratings: -; Package / Case: 1206 (3216 Metric); Size / Dimension: 0.126" L x 0.063" W (3.20mm x 1.60mm); Height: -; Thickness: 0.071" (1.80mm); Lead Spacing: -; Features: -; Packaging: Cut Tape (CT); Lead Style: -; ComponentLink1URL: http://search.murata.co.jp/Ceramy/image/img/PDF/ENG/GRM31C5C1E104JA01.pdf; ComponentLink1Description: http://search.murata.co.jp/Ceramy/image/img/PDF/ENG/GRM31C5C1E104JA01.pdf
R27 = RES_SM: as R72 on sheet MKXdbV2_DAC1; Supplier 1: Digi-Key; Supplier Part Number 1: 311-1.00KHRCT-ND; RoHS: RoHS Compliant; Category: Resistors; Stock 1: 4416298; Pricing 1: 10=0.014, 50=0.0104, 100=0.0079, 250=0.00584, 500=0.00432, 1000=0.00288 (USD); Resistance (Ohms): 1K; Composition: Thick Film; Features: -; Size / Dimension: 0.063" L x 0.031" W (1.60mm x 0.80mm); Height: 0.018" (0.45mm); Number of Terminations: 2; Packaging: Cut Tape (CT); Package / Case: 0603 (1608 Metric); ComponentLink1URL: http://www.yageo.com/documents/recent/PYu-RC0603_51_RoHS_L_4.pdf; ComponentLink1Description: http://www.yageo.com/documents/recent/PYu-RC0603_51_RoHS_L_4.pdf
R28 = RES_SM: as R73 on sheet MKXdbV2_DAC1; Supplier 1: Digi-Key; Supplier Part Number 1: 311-287HRCT-ND; RoHS: RoHS Compliant; Category: Resistors; Stock 1: 82528; Pricing 1: 10=0.014, 50=0.0104, 100=0.0079, 250=0.00584, 500=0.00432, 1000=0.00288 (USD); Resistance (Ohms): 287; Composition: Thick Film; Features: -; Size / Dimension: 0.063" L x 0.031" W (1.60mm x 0.80mm); Height: 0.018" (0.45mm); Number of Terminations: 2; Packaging: Cut Tape (CT); Package / Case: 0603 (1608 Metric); ComponentLink1URL: http://www.yageo.com/documents/recent/PYu-RC0603_51_RoHS_L_4.pdf; ComponentLink1Description: http://www.yageo.com/documents/recent/PYu-RC0603_51_RoHS_L_4.pdf
R29 R30 R32 R34 R36 R38 = RES_SM: as R74 on sheet MKXdbV2_DAC1; Supplier 1: Digi-Key; Supplier Part Number 1: RNCS0603BKE49R9CT-ND; RoHS: RoHS Compliant; Category: Resistors; Stock 1: 13782; Pricing 1: 1=0.7, 10=0.475, 50=0.2876, 100=0.2375, 250=0.18752, 500=0.16 (USD); Composition: Thin Film; Features: Anti-Corrosive, Moisture Resistant; Size / Dimension: 0.061" L x 0.031" W (1.55mm x 0.80mm); Height: 0.018" (0.45mm); Number of Terminations: 2; Packaging: Cut Tape (CT); Package / Case: 0603 (1608 Metric); ComponentLink1URL: http://www.seielect.com/Catalog/SEI-rncs.pdf; ComponentLink1Description: http://www.seielect.com/Catalog/SEI-rncs.pdf
R31 = RES_SM: as R76 on sheet MKXdbV2_DAC1; Supplier 1: Digi-Key; Supplier Part Number 1: RG16P10.0KBCT-ND; RoHS: RoHS Compliant; Category: Resistors; Stock 1: 368390; Pricing 1: 10=0.409, 50=0.2478, 200=0.2047, 1000=0.10342 (USD); Composition: Thin Film; Features: -; Size / Dimension: 0.063" L x 0.031" W (1.60mm x 0.80mm); Height: 0.016" (0.40mm); Number of Terminations: 2; Packaging: Cut Tape (CT); Package / Case: 0603 (1608 Metric); ComponentLink1URL: http://www.susumu-usa.com/pdf/RG_RM_RGH_DATASHEET.pdf; ComponentLink1Description: http://www.susumu-usa.com/pdf/RG_RM_RGH_DATASHEET.pdf
U12 = AD9783: DAC LVDS DUAL16BIT 500MSPS; Supplier 1: Digi-Key; Supplier Part Number 1: AD9783BCPZ-ND